# Altium schematic sheet TSI_SAMP_SAMI_V3.4.SchDoc (part 2 of 2)
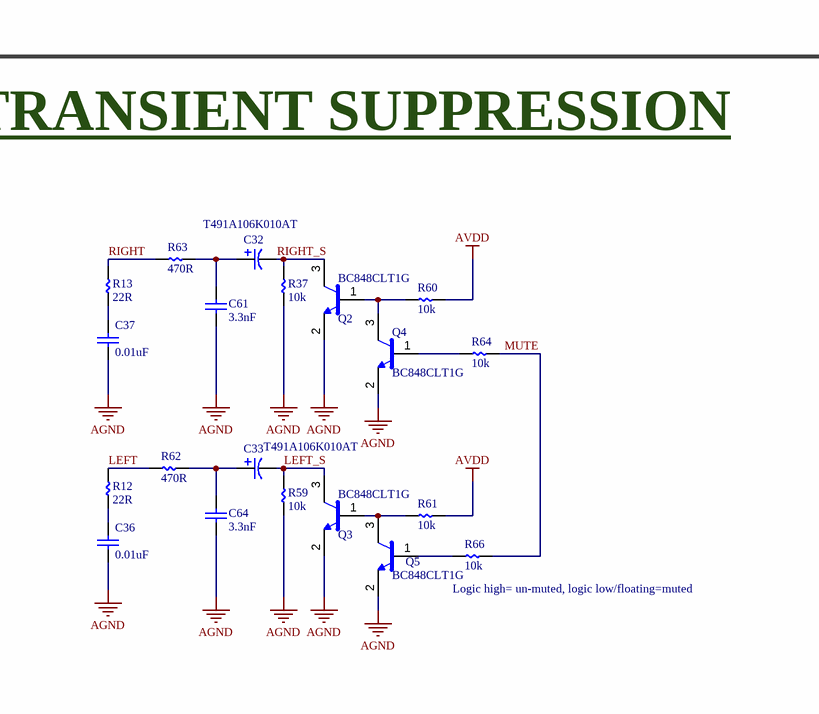
[diagram p6: TSI_SAMP_SAMI_V3.4.SchDoc, bottom right]

## Library data of the parts
C1-C4 = CAP_470pF_0603: 470 pF ±10% 50V Ceramic Capacitor X7R 0603 (1608 Metric); Supplier 1: Digi-Key; Supplier Part Number 1: 311-1078-1-ND
C5-C8 C10 C18 C23 C26 C34 C40 C43-C47 C50 C55 C56 = CAP_0.1uF_0603: 0603 100 nF 25 V -20 / +80 % Tolerance Y5V SMT Multilayer Ceramic Capacitor; Manufacturer: Kyocera AVX; Manufacturer Part Number: KGM15AV51E104ZT; Capacitance: 100nF; Voltage Rating (DC): 25V; Tolerance: 80%; Dissipation Factor: 7%; Insulation Resistance: 100GR; RoHS: Yes; Category: Ceramic Capacitors; Mount: Surface Mount,PCB; Case/Package: 0603; Number of Pins: 2; Case Code (Imperial): 0603; Case Code (Metric): 1608; Contact Plating: Tin,Matte; Case Code: 0603; Min Operating Temperature: -30°C; Max Operating Temperature: 85°C; Packaging: Tape and Reel; Voltage Rating: 25V; Package Quantity: 1; Dielectric: Y5V; Termination: SMD/SMT; Voltage: 25V; Series: -; Construction: Flat; Length: 1.6mm; Width: 0.032inch; Height: 0.9mm; Thickness: 0.035inch; Depth: 0.81mm; Radiation Hardening: No; REACH SVHC: No SVHC; Lead Free: Lead Free; RoHS Compliant: Yes; ComponentLink1URL: https://datasheet.ciiva.com/11786/0900766b802d4699-11786267.pdf?src-supplier=RSComponents; ComponentLink1Description: https://datasheet.ciiva.com/11786/0900766b802d4699-11786267.pdf?src-supplier=RSComponents; ComponentLink2URL: https://datasheet.ciiva.com/1124/318409-1124608.pdf?src-supplier=Element14; ComponentLink2Description: https://datasheet.ciiva.com/1124/318409-1124608.pdf?src-supplier=Element14; ComponentLink3URL: https://datasheet.ciiva.com/203/cy5v-203689.pdf?src-supplier=Digi-Key; ComponentLink3Description: https://datasheet.ciiva.com/203/cy5v-203689.pdf?src-supplier=Digi-Key; ComponentLink4URL: https://datasheet.ciiva.com/203/cy5v-203690.pdf?src-supplier=Digi-Key; ComponentLink4Description: https://datasheet.ciiva.com/203/cy5v-203690.pdf?src-supplier=Digi-Key; ComponentLink5URL: https://datasheet.ciiva.com/203/cy5v-203691.pdf?src-supplier=Digi-Key; ComponentLink5Description: https://datasheet.ciiva.com/203/cy5v-203691.pdf?src-supplier=Digi-Key; ComponentLink6URL: https://datasheet.ciiva.com/11464/cy5v-11464567.pdf?src-supplier=Avnet; ComponentLink6Description: https://datasheet.ciiva.com/11464/cy5v-11464567.pdf?src-supplier=Avnet; ComponentLink7URL: https://datasheet.ciiva.com/2987/cy5v-2987766.pdf?src-supplier=Avnet; ComponentLink7Description: https://datasheet.ciiva.com/2987/cy5v-2987766.pdf?src-supplier=Avnet; ComponentLink8URL: https://datasheet.ciiva.com/1124/578190-1124654.pdf?src-supplier=Element14; ComponentLink8Description: https://datasheet.ciiva.com/1124/578190-1124654.pdf?src-supplier=Element14; ComponentLink9URL: https://datasheet.ciiva.com/1124/578190-1124655.pdf?src-supplier=Element14; ComponentLink9Description: https://datasheet.ciiva.com/1124/578190-1124655.pdf?src-supplier=Element14; ComponentLink10URL: https://datasheet.ciiva.com/14590/70001073-14590664.pdf?src-supplier=Allied+Electronics; ComponentLink10Description: https://datasheet.ciiva.com/14590/70001073-14590664.pdf?src-supplier=Allied+Electronics; ComponentLink11URL: https://datasheet.ciiva.com/28613/578190-28613276.pdf?src-supplier=Element14; ComponentLink11Description: https://datasheet.ciiva.com/28613/578190-28613276.pdf?src-supplier=Element14; ComponentLink12URL: https://datasheet.ciiva.com/16484/cy5v-16484423.pdf?src-supplier=Avnet+Asia; ComponentLink12Description: https://datasheet.ciiva.com/16484/cy5v-16484423.pdf?src-supplier=Avnet+Asia; Supplier 1: DigiKey; Supplier Part Number 1: 478-KGM15AV51E104ZTCT-ND
C9 C12 C15 C21 C25 C35 C38 C39 C53 C54 C63 C67-C69 = CAP_10uF_0603: Yageo - CC0603MRX5R7BB106 - CAP, MLCC, X5R, 10uF, 16V, 0603; Dielectric Material: Ceramic; Tolerance: 20%; Supplier 1: DigiKey; Supplier Part Number 1: 311-1822-1-ND; Manufacturer: Yageo; Manufacturer Part Number: CC0603MRX5R7BB106; RoHS: Yes; Category: Ceramic Capacitors; Stock 1: 109429; Pricing 1: 1=0.32000, 10=0.22000, 50=0.14680, 100=0.12470, 500=0.08804, 1000=0.07704 (USD); Mount: PCB,Surface Mount; Case/Package: 0603; Number of Pins: 2; Case Code (Imperial): 0603; Case Code (Metric): 1608; Min Operating Temperature: -55°C; Max Operating Temperature: 85°C; Capacitance: 10uF; Packaging: Tape and Reel; Dielectric: X5R; Voltage Rating: 16V; Voltage Rating (DC): 16V; Construction: Flat; Termination: SMD/SMT; Length: 1.6mm; Height: 0.8mm; Depth: 0.8mm; Radiation Hardening: No; RoHS Compliant: Yes; REACH SVHC: No SVHC; Supplier 2: Mouser; Supplier Part Number 2: 603-CC603MRX5R7BB106
C11 = CAP_1nF_0603: CAP CER 0603 1NF 16V X7R 10%; Supplier 1: Digi-Key; Supplier Part Number 1: 399-17878-1-ND
C13 C14 C20 C24 C27 C29-C31 C57 = CAP_1uF_0603: 0603 1 uF 50 V ±10% Tolerance X5R Surface Mount Multilayer Ceramic Capacitor; Manufacturer: Taiyo Yuden; Manufacturer Part Number: UMK107BJ105KA-T; Voltage Rating: 50V; Supplier 1: Digi-Key; RoHS: Yes; Category: Ceramic Capacitors; Stock 1: 555277; Pricing 1: 1=0.19000, 10=0.12900, 50=0.07760, 100=0.06560, 500=0.04484, 1000=0.03968 (USD); Mount: Surface Mount; Case/Package: 0603; Number of Pins: 2; Case Code (Metric): 1608; Case Code (Imperial): 0603; Contact Plating: Nickel; Min Operating Temperature: -55°C; Max Operating Temperature: 85°C; Capacitance: 1uF; Tolerance: 10%; Packaging: Tape and Reel; Package Quantity: 1; Voltage Rating (DC): 50V; Dielectric: X5R; Termination: SMD/SMT; Series: M; Construction: Flat; Length: 1.6mm; Width: 0.031inch; Height: 0.8mm; Thickness: 0.035inch; Depth: 0.8mm; Radiation Hardening: No; RoHS Compliant: Yes; REACH SVHC: Unknown; Halogen Free: Halogen Free; ComponentLink1URL: https://datasheet.ciiva.com/134/umk107bj105ka-t-ss-134740.pdf?src-supplier=Digi-Key; ComponentLink1Description: https://datasheet.ciiva.com/134/umk107bj105ka-t-ss-134740.pdf?src-supplier=Digi-Key; ComponentLink2URL: https://datasheet.ciiva.com/11601/umk107bj105ka-t-ss-11601811.pdf?src-supplier=Avnet; ComponentLink2Description: https://datasheet.ciiva.com/11601/umk107bj105ka-t-ss-11601811.pdf?src-supplier=Avnet; ComponentLink3URL: https://datasheet.ciiva.com/5744/1697715-5744913.pdf?src-supplier=Farnell; ComponentLink3Description: https://datasheet.ciiva.com/5744/1697715-5744913.pdf?src-supplier=Farnell; ComponentLink4URL: https://datasheet.ciiva.com/30199/43umk107bj105ka-t-30199791.pdf?src-supplier=Onlinecomponents.com; ComponentLink4Description: https://datasheet.ciiva.com/30199/43umk107bj105ka-t-30199791.pdf?src-supplier=Onlinecomponents.com; ComponentLink5URL: https://datasheet.ciiva.com/15922/336umk107bj105ka-t-15922611.pdf?src-supplier=Onlinecomponents.com; ComponentLink5Description: https://datasheet.ciiva.com/15922/336umk107bj105ka-t-15922611.pdf?src-supplier=Onlinecomponents.com; ComponentLink6URL: https://datasheet.ciiva.com/5427/mlcc-all-e-541559-5427036.pdf?src-supplier=Mouser; ComponentLink6Description: https://datasheet.ciiva.com/5427/mlcc-all-e-541559-5427036.pdf?src-supplier=Mouser; ComponentLink7URL: https://datasheet.ciiva.com/7975/mlcc-all-e-7975898.pdf?src-supplier=Element14; ComponentLink7Description: https://datasheet.ciiva.com/7975/mlcc-all-e-7975898.pdf?src-supplier=Element14; ComponentLink8URL: https://datasheet.ciiva.com/7975/1697715-7975608.pdf?src-supplier=Element14; ComponentLink8Description: https://datasheet.ciiva.com/7975/1697715-7975608.pdf?src-supplier=Element14; ComponentLink9URL: https://datasheet.ciiva.com/22694/1697715-22694278.pdf?src-supplier=Element14; ComponentLink9Description: https://datasheet.ciiva.com/22694/1697715-22694278.pdf?src-supplier=Element14; Supplier Part Number 1: 587-2400-1-ND
C16 C17 = CAP CER 10UF 16V X7R 1206: 10µF ±20% 16V Ceramic Capacitor X7R 1206 (3216 Metric); Manufacturer: Samsung Electro-Mechanics; Manufacturer Part Number: CL31B106MOHNNNE; Value: 10uF; Manufacturer Link: https://media.digikey.com/pdf/Data%20Sheets/Samsung%20PDFs/CL_Series_MLCC_ds.pdf; RoHS: 3; Temperature Range: -55°C ~ 125°C; Supplier 1: Digi-Key; Supplier 2: Future Electronics; Supplier Part Number 1: 1276-6641-1-ND; Supplier Part Number 2: 2114712
C19 C22 = CAP ALUM 330UF 20% 50V SMD: 330µF 50V Aluminum Electrolytic Capacitors Radial, Can - SMD 120mOhm @ 100kHz 5000 Hrs @ 105°C; Manufacturer: Panasonic Electronic Components; Manufacturer Part Number: EEE-FT1H331GP; Value: 330uF; Manufacturer Link: https://b2b-api.panasonic.eu/file_stream/pids/fileversion/3127; RoHS: 3; Temperature Range: -55°C ~ 105°C; Supplier 1: Digi-Key; Supplier Part Number 1: 732-8514-1-ND
C28 = CAP 2.2uF 0603 16V X7R 10%: 2.2µF ±10% 16V Ceramic Capacitor X7R 0603 (1608 Metric); Manufacturer: Taiyo Yuden; Manufacturer Part Number: EMK107BB7225KA-T; Value: 2.2uF; Manufacturer Link: https://www.yuden.co.jp/productdata/catalog/mlcc06_e.pdf; RoHS: ROHS3 Compliant; Temperature Range: -55°C ~ 125°C; Supplier 1: Digi-Key; Supplier Part Number 1: 587-5835-1-ND; Supplier 2: Mouser; Supplier Part Number 2: 81-GRM188R71A225KE15
C32 C33 = T491A106K010AT: T491, Tantalum, MnO2 Tantalum, Commercial Grade, 10 uF, 10%, 10 VDC, SMD, MnO2, Molded, 3.8 Ohms, 3216, Height Max = 1.8mm; Manufacturer Name: Kemet; Copyright: Copyright (C) 2025 Ultra Librarian. All rights reserved.; Supplier 1: DigiKey; Supplier Part Number 1: 399-3684-1-ND; Supplier 2: Mouser; Supplier Part Number 2: 80-T491A106K010; Manufacturer Part Number: T491A106K010AT
C36 C37 = CAP_0.01uF_0603: CAP CER SMD 0603 .01UF 5% X7R 50; Supplier 1: Digi-Key; Supplier Part Number 1: 399-17568-1-ND
C41 C42 = CAP_22pF_0603: 22 pF ±5% 250V Ceramic Capacitor C0G, NP0 0603 (1608 Metric); Supplier 1: Digi-Key; Supplier Part Number 1: 311-3095-1-ND
C48 C49 = CAP_15pF_0603: Manufacturer: KYOCERA AVX; Manufacturer Product Number: KGM15ACG1H150JT; Supplier 1: DigiKey; Supplier Part Number 1: 478-KGM15ACG1H150JTCT-ND
C51 C52 = CAP_10nF_0603: 10000 pF ±5% 16V Ceramic Capacitor X8R 0603 (1608 Metric); Supplier 1: Digi-Key; Supplier Part Number 1: 399-C0603X103J4HAC7867CT-ND
C58 C59 = CAP_1uF_1210: CAP CER 1UF 50V X7R 1210; Manufacturer 1: KEMET; Manufacturer Product Number 1: C1210C105J5RACTU; Supplier 1: Digi-Key; Supplier Part Number 1: 399-C1210C105J5RAC7800CT-ND
C60 = CAP_100pF_0603: CAP CER 100PF 50V X8R 0603; Supplier 1: Digi-Key; Supplier Part Number 1: 399-C0603C101F5HAC7867CT-ND
C61 C64 = CAP_3.3nF_0603: 0603 3.3nF SMT Multilayer Ceramic Capacitor; Manufacturer: KEMET; Manufacturer Part Number: C0603C332J5RACTU; Voltage Rating (DC): 50V; Tolerance: 5%; Dielectric: X7R; Dissipation Factor: 7%; Insulation Resistance: 100GR; RoHS: Yes; Category: Ceramic Capacitors; Mount: Surface Mount,PCB; Case/Package: 0603; Number of Pins: 2; Case Code (Imperial): 0603; Case Code (Metric): 1608; Contact Plating: Tin,Matte; Case Code: 0603; Min Operating Temperature: -55°C; Max Operating Temperature: 125°C; Capacitance: 3.3nF; Packaging: Tape and Reel; Voltage Rating: 50V; Package Quantity: 1; Termination: SMD/SMT; Voltage: 50V; Series: -; Construction: Flat; Length: 1.6mm; Width: 0.032inch; Height: 0.9mm; Thickness: 0.035inch; Depth: 0.81mm; Radiation Hardening: No; REACH SVHC: No SVHC; Lead Free: Lead Free; RoHS Compliant: Yes; Supplier 1: DigiKey; Supplier Part Number 1: 399-C0603C332J5RACTUCT-ND
C62 = CAP_0.047uF_0603: CAP CER 0.047UF 50V X7R 0603; Manufacturer: KEMET; Manufacturer Product Number: C0603C473K5RACTU; Supplier 1: DigiKey; Supplier Part Number 1: 399-C0603C473K5RACTUCT-ND
C65 C66 = CAP_0.47uF_0603: 0.47 µF ±20% 25V Ceramic Capacitor X5R 0603 (1608 Metric); Supplier 1: Digi-Key; Supplier Part Number 1: 732-7917-1-ND
D1 D2 = TPD2E007DCKR: TVS DIODE 13V SC70-3; Manufacturer: Texas Instruments; Manufacturer Part Number: TPD2E007DCKR; Manufacturer Link: https://www.ti.com/lit/ds/symlink/tpd2e007.pdf?HQS=TI-null-null-digikeymode-df-pf-null-wwe&ts=1600795141321; Value: TPD2E007DCKR; RoHS: ROHS3 Compliant; Temperature Range: -40°C~85°C (TA); Supplier 1: DigiKey; Supplier Part Number 1: 296-25281-1-ND
D3 = SCHOTTKY_20V_3A_SMB: Diode Schottky 20V 3A 2-Pin SMB T/R; Manufacturer: Diodes; Manufacturer Part Number: B320B-13-F; Number of Terminals/Pins: 2; Package Body Material: Plastic; Diode Element Material: SILICON; Max Reverse Current: 500uA; Peak Non-Repetitive Surge Current: 100A; Element Configuration: Single; Forward Voltage: 500mV; Number of Elements: 1; Polarity: Standard; Capacitance: 250pF; Application(s): EFFICIENCY; Diode Type: RECTIFIER; Time @ Peak Reflow Temperature-Max (s): 5s; Supplier 1: Digi-Key; RoHS: Yes; Category: Schottky Diodes; Stock 1: 1260; Pricing 1: 1=0.43000, 10=0.37100, 100=0.27720, 500=0.21780, 1000=0.16830 (USD); Mount: Surface Mount; Case/Package: SMB; Number of Pins: 2; Weight: 0.00328oz; Contact Plating: Tin,Matte; Package Shape: Rectangular; Terminal Finish: Tin; Min Operating Temperature: -55°C; Max Operating Temperature: 150°C; Forward Current: 3A; Max Repetitive Reverse Voltage (Vrrm): 20V; Packaging: Tape and Reel; Package Quantity: 3000; Average Rectified Current: 3A; Max Forward Surge Current (Ifsm): 100A; Termination: SMD/SMT; Voltage Rating (DC): 20V; Current Rating: 3A; Output Current: 3A; Max Reverse Voltage (DC): 20V; Series: -; JESD-30 Code: R-PDSO-C2; Terminal Form: C BEND; Terminal Position: DUAL; Number of Phases: 1; Surface Mount: Yes; Moisture Sensitivity Level: 1; Technology: SCHOTTKY; Peak Reflow Temperature (Cel): 245°C; Length: 4.57mm; Width: 3.94mm; Height: 2.5mm; Radiation Hardening: No; Lead Free: Lead Free; ComponentLink1URL: https://datasheet.ciiva.com/26949/getdatasheetpartid-143396-26949350.pdf?src-supplier=Verical; ComponentLink1Description: https://datasheet.ciiva.com/26949/getdatasheetpartid-143396-26949350.pdf?src-supplier=Verical; ComponentLink2URL: https://datasheet.ciiva.com/19477/1589540-19477593.pdf?src-supplier=Jameco; ComponentLink2Description: https://datasheet.ciiva.com/19477/1589540-19477593.pdf?src-supplier=Jameco; ComponentLink3URL: https://datasheet.ciiva.com/26788/b320b-13-f-26788850.pdf?src-supplier=IIIC; ComponentLink3Description: https://datasheet.ciiva.com/26788/b320b-13-f-26788850.pdf?src-supplier=IIIC; ComponentLink4URL: https://datasheet.ciiva.com/914/ds30924-914408.pdf?src-supplier=Digi-Key; ComponentLink4Description: https://datasheet.ciiva.com/914/ds30924-914408.pdf?src-supplier=Digi-Key; ComponentLink5URL: https://datasheet.ciiva.com/914/ds30924-914409.pdf?src-supplier=Digi-Key; ComponentLink5Description: https://datasheet.ciiva.com/914/ds30924-914409.pdf?src-supplier=Digi-Key; ComponentLink6URL: https://datasheet.ciiva.com/914/ds30924-914410.pdf?src-supplier=Digi-Key; ComponentLink6Description: https://datasheet.ciiva.com/914/ds30924-914410.pdf?src-supplier=Digi-Key; ComponentLink7URL: https://datasheet.ciiva.com/25946/ds30924-25946725.pdf?src-supplier=Avnet+Europe; ComponentLink7Description: https://datasheet.ciiva.com/25946/ds30924-25946725.pdf?src-supplier=Avnet+Europe; Supplier Part Number 1: B320B-FDICT-ND
D4 = LED_GREEN_0603: LED GREEN CLEAR SMD; Supplier 1: Digi-Key; Supplier Part Number 1: 160-1446-1-ND
D5 D6 = LED_RED_0603: LED RED CLEAR SMD; Supplier 1: Digi-Key; Supplier Part Number 1: 160-1447-1-ND
DS1 = LCD_Screen_16x2: SPARKFUN 16X2 SERLCD - RGB TEXT; Manufacturer: SparkFun Electronics; Manufacturer Product Number: 16397; Supplier 1: Digi-Key
F1-F3 = FER_8A_4mOHM_0603: 8.5 Ohms @ 100 MHz 1 Power Line Ferrite Bead 0603 (1608 Metric) 8A 4mOhm; Supplier 1: Digi-Key; Supplier Part Number 1: 490-BLE18PS080SN1DCT-ND
FB1-FB4 = FERRITE BEAD 220 OHM 0805 1LN: 220 Ohms @ 100MHz 1 Power Line Ferrite Bead 0805 (2012 Metric) 3A 40mOhm; Manufacturer: TDK Corporation; Manufacturer Part Number: MPZ2012S221AT000; Value: 220R 3A; Manufacturer Link: https://product.tdk.com/info/en/catalog/datasheets/beads_commercial_power_mpz2012_en.pdf?ref_disty=digikey; RoHS: 3; Temperature Range: -55°C ~ 125°C; Supplier 1: Digi-Key; Supplier Part Number 1: 240-2392-1-ND
H1 = TAG_CONNECT_TC2030: TC2030-IDC; Supplier 1: Digi-Key; Supplier Part Number 1: TC2030-IDC-ND
H2 = 16-Pin_B2B: Mechanical Part DW-16-07-T-S-200 for use as board to board connector for DS1; Manufacturer 1: Samtec Inc.; Supplier 1: Mouser; Supplier Part Number 1: 200-DW1607TS200; Supplier 2: DigiKey; Supplier Part Number 2: DW-16-07-T-S-200-ND; Manufacturer Product Number 1: DW-16-07-T-S-200
J1 = CONN_DC_JACK_2.1mmID_5.5mmOD_RA_TH: Power Barrel Connector Jack 2.10mm ID (0.083"), 5.50mm OD (0.217") Through Hole, Right Angle; Supplier 1: Digi-Key; Supplier 2: Mouser; Supplier Part Number 1: CP-051AH-ND; Supplier Part Number 2: 490-PJ-051AH
J2 J5 J12 = CONN_JACK_STEREO_3.5MM_SPDT_RA: 3.50mm (0.141", 1/8", Mini Plug) - Headphone Phone Jack Stereo (3 Conductor, TRS) Connector Solder; Supplier 1: DigiKey; Supplier Part Number 1: CP-SJ-3566AN-ND; Supplier 2: DigiKey; Supplier Part Number 2: CP-SJ-3566AN-ND; Supplier 3: Mouser; Supplier Part Number 3: 490-SJ-3566AN
J3 J4 = CONN_3.5MM_COMBO: 3.50mm (0.141", 1/8", Mini Plug) - Headphone Phone Jack Stereo (3 Conductor, TRS) Connector Solder; Supplier 1: Digi-Key; Supplier Part Number 1: 2092-STX-4235-3/3-N-ND
J6 J7 = CONN_3.5MM_STEREO_DBL_VERT_TH: 3.50mm (0.141", 1/8", Mini Plug) - Headphone Phone Jack Stereo (3 Conductor, TRS) Connector Solder; Supplier 1: Digi-Key; Supplier Part Number 1: 2092-STX-4235-3/3-N-ND
J8 = CONN_SD_CARD_SMD: 8 Position Card Connector Secure Digital - microSDâ„¢ Surface Mount, Right Angle Gold; MP: 2908-05WB-MG; MF: 3M; SnapEDA_Link: https://www.snapeda.com/parts/2908-05WB-MG/3M%20%28TC%29/view-part/292159/?ref=snap; Value: *; Package: None; Digi-Key_Part_Number: 3M5607CT-ND; Digi-Key_Purchase_URL: https://www.digikey.in/product-detail/en/3m/2908-05WB-MG/3M5607CT-ND/1242498?utm_source=snapeda&utm_medium=aggregator&utm_campaign=symbol; Supplier 1: Digi-Key; Supplier Part Number 1: 3M5607CT-ND
J9 = 687310124422: Wurth Elektronik 687 0.5mm Pitch 10 Way Straight SMT FPC Connector; Geometry.Height: 4.45mm; Mouser Part Number: 710-687310124422; Mouser Price/Stock: https://www.mouser.co.uk/ProductDetail/Wurth-Elektronik/687310124422?qs=qR1qlUC5%2FYSwH5sZ3IPHvQ%3D%3D; Manufacturer_Name: Wurth Elektronik; Manufacturer_Part_Number: 687310124422; Datasheet Link: https://www.we-online.com/catalog/datasheet/687310124422.pdf
J10 = 68000-105HTLF: 68000-105HTLF-B/S SR HDR 1*5; Manufacturer 1: Amphenol Communication Solutions; Geometry.Height: 8.58mm; Datasheet Link: https://cdn.amphenol-cs.com/media/wysiwyg/files/drawing/68000.pdf; Manufacturer Part Number 1: 68000-105HTLF; Supplier 1: DigiKey; Supplier Part Number 1: 609-68000-105HTLF-ND; Supplier 2: Mouser; Supplier Part Number 2: 649-68000-105HTLF
J11 = 3220-10-0300-00: Connector Header Surface Mount 10 position 0.050" (1.27mm); Manufacturer 1: CNC Tech; Datasheet Link: https://www.cnctech.us/pdfs/3220-XX-0300-00_.pdf; Supplier 1: DigiKey; Supplier Part Number 1: 1175-1629-ND; Manufacturer Part Number 1: 3220-10-0300-00
M1 = LED Dome_4LED: LENS WHITE 170DEG DIFFUSER SNAP; Manufacturer: Khatod North America LLC; Manufacturer Part Number: PLJT20; Lens Style: Round with Domed Top; Lens Size: 23mm Dia; Lens Transparency: Diffused; Viewing Angle: 170°; RoHS: RoHS Compliant; Category: Optoelectronics; Stock 1: 241; Pricing 1: 1=3.32, 10=2.941, 50=2.1818, 100=1.8972, 250=1.70748 (USD); Part Status: Active; Type: Lens; Color: White; Optical Pattern: Diffuser; For Use With/Related Manufacturer: -; Material: Polycarbonate; Mounting Type: Snap In; ComponentLink1URL: http://download.khatod.com/documents/pljt20_test_report.pdf; ComponentLink1Description: http://download.khatod.com/documents/pljt20_test_report.pdf; Supplier 1: Digi-Key
MK1 = MIC_ELECTRET_CASTLE_PAD: 20 Hz ~ 20 kHz Analog Microphone Electret Condenser Omnidirectional (-24dB ±3dB) Solder Pads; Manufacturer Product Number: AOM-5024L-HD-R; Manufacturer: PUI Audio, Inc.; Supplier 1: Digi-Key; Supplier Part Number 1: 668-1596-ND
P1 = TERM BLK 4P SIDE ENT 2.54MM PCB: 4 Position Wire to Board Terminal Block Horizontal with Board 0.100" (2.54mm) Through Hole; Manufacturer: Phoenix Contact; Value: 1725672; Manufacturer Link: https://media.digikey.com/pdf/Data%20Sheets/Phoenix%20Contact%20PDFs/1725672.pdf; Manufacturer Part Number: 1725672; RoHS: Y; Temperature Range: *; Supplier 1: Digi-Key; Supplier 2: Mouser; Supplier Part Number 1: 277-1275-ND; Supplier Part Number 2: 651-1725672
P2 = TERM BLK 2P SIDE ENT 2.54MM PCB: 2 Position Wire to Board Terminal Block Horizontal with Board 0.100" (2.54mm) Through Hole; Manufacturer: Phoenix Contact; Value: 1725656; Manufacturer Link: https://media.digikey.com/pdf/Data%20Sheets/Phoenix%20Contact%20PDFs/1725656_Ds.pdf; Manufacturer Part Number: 1725656; RoHS: Y; Temperature Range: *; Supplier 1: Digi-Key; Supplier 2: Mouser; Supplier Part Number 1: 277-1273-ND; Supplier Part Number 2: 651-1725656
Q1 = MOSFET_P-CH_20V_3.6A_SOT23: Trans MOSFET P-CH 20V 3.6A 3-Pin SOT-23 T/R; Manufacturer: ON Semiconductor; Manufacturer Part Number: NTR3A052PZT1G; Rds On Max: 47mR; Input Capacitance: 1.243nF; Max Power Dissipation: 860mW; RoHS: Yes; Category: MOSFETs; Stock 1: 9236; Pricing 1: 1=0.44000, 10=0.37500, 25=0.35040, 100=0.28030, 500=0.22022, 1000=0.17017 (USD); Mount: Surface Mount; Case/Package: TO-236-3; Min Operating Temperature: -55°C; Max Operating Temperature: 150°C; Packaging: Cut Tape; Drain to Source Voltage (Vdss): 20V; Continuous Drain Current (ID): 3.6A; RoHS Compliant: Yes; ComponentLink1URL: http://www.onsemi.com/pub/Collateral/NTR3A052PZ-D.PDF?src-supplier=Digi-Key; ComponentLink1Description: http://www.onsemi.com/pub/Collateral/NTR3A052PZ-D.PDF?src-supplier=Digi-Key; Supplier 1: Digi-Key; Supplier Part Number 1: 31-DMP2045UQ-7CT-ND
R1 R4 R39-R42 R52-R55 = RES_100K_0603: Res Thick Film 0603 100K Ohm 5% 0.33W(1/3W) ±200ppm/°C Pad SMD Automotive T/R; Manufacturer: Vishay Dale; Manufacturer Part Number: CRCW0603100KJNEAHP; Resistance: 100kR; Power Rating: 250mW; Voltage Rating: 75V; Supplier 1: Digi-Key; RoHS: Yes; Category: Chip SMD Resistors; Stock 1: 27580; Pricing 1: 1=0.16000, 10=0.13500, 100=0.05290, 1000=0.02215, 2500=0.02030 (USD); Case/Package: 0603; Case Code (Imperial): 0603; Case Code (Metric): 1608; Contact Plating: Tin; Weight: 7.1E-05oz; Min Operating Temperature: -55°C; Max Operating Temperature: 155°C; Packaging: Tape and Reel; Tolerance: 5%; Resistor Type: Thick Film; Temperature Coefficient: 200ppm/°C; Max Power Dissipation: 250mW; Series: CRCW-HP; Number of Terminations: 2; Features: Automotive AEC-Q200; Package Quantity: 5000; Length: 1.6mm; Width: 0.8mm; Height: 0.45mm; Radiation Hardening: No; RoHS Compliant: Yes; Lead Free: Lead Free; ComponentLink1URL: https://datasheet.ciiva.com/5548/crcwhpe3-46056-5548151.pdf?src-supplier=Mouser; ComponentLink1Description: https://datasheet.ciiva.com/5548/crcwhpe3-46056-5548151.pdf?src-supplier=Mouser; Supplier Part Number 1: 541-100KSACT-ND
R2 = RES_3.6M_0603: RES 3.6M OHM 1% 1/10W 0603; Supplier 1: Digi-Key; Supplier Part Number 1: RMCF0603FT3M60CT-ND
R3 = 2M Resistor: RES 2M OHM 5% 1/10W 0603; Manufacturer Part Number 1: RC0603JR-072ML; Manufacturer 1: YAGEO; Supplier 1: DigiKey; Supplier Part Number 1: 311-2.0MGRCT-ND; Supplier 2: Mouser; Supplier Part Number 2: 603-RC0603JR-072ML; Supplier 3: Avnet; Supplier Part Number 3: 49AK2948
R5 R6 R9 R10 = RES_20K_0603: 20 kOhms ±1% 0.1W, 1/10W Chip Resistor 0603 (1608 Metric) Automotive AEC-Q200 Thick Film; Supplier 1: Digi-Key; Supplier Part Number 1: RMCF0603FT20K0CT-ND
R7 = RES_2K1_0603: 2.1 kOhms ±1% 0.1W, 1/10W Chip Resistor 0603 (1608 Metric) Moisture Resistant Thick Film; Manufacturer Product Number: RC0603FR-072K1L; Manufacturer: YAGEO; Supplier 1: DigiKey; Supplier Part Number 1: 311-2.10KHRCT-ND; Resistance: 2.1 kOhms; Supplier 2: Mouser; Supplier Part Number 2: 603-RC0603FR-072K1L
R8 R11 R26 R28 R30 R32 R34 R36 R37 R43 R48-R50 R59-R61 R64 R66 = RES_10K_0603: Res Thick Film 0603 10K Ohm 5% 1/10W 200ppm/C Molded SMD SMD Paper T/R; Manufacturer: Vishay Dale; Manufacturer Part Number: CRCW060310K0JNEA; Resistance: 10kR; Power Rating: 100mW; Voltage Rating: 75V; Temperature Coefficient: 200ppm/°C; RoHS: Yes; Category: Chip SMD Resistors; Stock 1: 2; Pricing 1: 1=0.10000, 10=0.03200, 100=0.01310, 1000=0.00588, 2500=0.00510 (USD); Mount: Surface Mount; Case/Package: 0603; Number of Pins: 2; Case Code (Metric): 1608; Case Code (Imperial): 0603; Contact Plating: Tin; Size Code: 0603; Weight: 7.1E-05oz; Min Operating Temperature: -55°C; Max Operating Temperature: 155°C; Package Quantity: 1; Packaging: Tape and Reel; Series: CRCW; Resistance Tolerance: 5%; Tolerance: 5%; Max Power Dissipation: 100mW; Resistor Type: Thick Film; Number of Terminations: 2; Construction: Rectangular; Termination: SMD/SMT; Voltage Rating (DC): 75V; Features: Automotive AEC-Q200; Length: 1.55mm; Width: 0.033inch; Height: 0.02inch; Depth: 0.85mm; Radiation Hardening: No; REACH SVHC: Unknown; Lead Free: Lead Free; RoHS Compliant: Yes; Military Standard: Not; ComponentLink1URL: https://datasheet.ciiva.com/3256/dcrcwe3-3256943.pdf?src-supplier=Avnet; ComponentLink1Description: https://datasheet.ciiva.com/3256/dcrcwe3-3256943.pdf?src-supplier=Avnet; ComponentLink2URL: https://datasheet.ciiva.com/2461/dcrcwe3-2461971.pdf?src-supplier=Digi-Key; ComponentLink2Description: https://datasheet.ciiva.com/2461/dcrcwe3-2461971.pdf?src-supplier=Digi-Key; ComponentLink3URL: https://datasheet.ciiva.com/2461/dcrcwe3-2461972.pdf?src-supplier=Digi-Key; ComponentLink3Description: https://datasheet.ciiva.com/2461/dcrcwe3-2461972.pdf?src-supplier=Digi-Key; ComponentLink4URL: https://datasheet.ciiva.com/2461/dcrcwe3-2461973.pdf?src-supplier=Digi-Key; ComponentLink4Description: https://datasheet.ciiva.com/2461/dcrcwe3-2461973.pdf?src-supplier=Digi-Key; ComponentLink5URL: https://datasheet.ciiva.com/3256/dcrcwe3-3256942.pdf?src-supplier=Avnet; ComponentLink5Description: https://datasheet.ciiva.com/3256/dcrcwe3-3256942.pdf?src-supplier=Avnet; ComponentLink6URL: https://datasheet.ciiva.com/16343/dcrcwe3-16343525.pdf?src-supplier=Future+Electronics; ComponentLink6Description: https://datasheet.ciiva.com/16343/dcrcwe3-16343525.pdf?src-supplier=Future+Electronics; ComponentLink7URL: https://datasheet.ciiva.com/16755/70201119-16755717.pdf?src-supplier=Allied+Electronics; ComponentLink7Description: https://datasheet.ciiva.com/16755/70201119-16755717.pdf?src-supplier=Allied+Electronics; ComponentLink8URL: https://datasheet.ciiva.com/16515/dcrcwe3-16515020.pdf?src-supplier=Avnet+Asia; ComponentLink8Description: https://datasheet.ciiva.com/16515/dcrcwe3-16515020.pdf?src-supplier=Avnet+Asia; ComponentLink9URL: https://datasheet.ciiva.com/16771/70201119-16771051.pdf?src-supplier=Allied+Electronics; ComponentLink9Description: https://datasheet.ciiva.com/16771/70201119-16771051.pdf?src-supplier=Allied+Electronics; Supplier 1: Digi-Key; Supplier Part Number 1: RMCF0603FT10K0CT-ND
R12 R13 = RES_22R_0603: RES 22 OHM 1% 1/10W 0603; Supplier 1: Digi-Key; Supplier Part Number 1: A129668CT-ND
R14 R15 R44-R47 R58 R71 R73 = RES_1K_0603: 1 kOhms ±1% 0.25W, 1/4W Chip Resistor 0603 (1608 Metric) Pulse Withstanding Thick Film; Supplier 1: Digi-Key; Supplier Part Number 1: 541-3949-1-ND
R16-R19 R27 R29 R31 R33 R35 R65 R67-R70 R72 R74-R92 = RES_0R_0603: RES SMD 0 OHM JUMPER 1/10W 0603; Supplier 1: Digi-Key; Supplier Part Number 1: A106051CT-ND
R20 R21 = RES_4K7_0603: RES 4.7K OHM 1% 1/4W 0603; Supplier 1: Digi-Key; Supplier Part Number 1: A130424CT-ND
R22-R25 = RES_190R_0603: RES 191 OHM 1% 1/10W 0603; Supplier 1: Digi-Key; Supplier Part Number 1: 311-191HRCT-ND
R38 = RES_1M_0603: RES 1M OHM 1% 1/4W 0603; Supplier 1: Digi-Key; Supplier Part Number 1: A130452CT-ND
R51 R56 = RES_100R_0603: 100 Ohms ±1% 0.25W, 1/4W Chip Resistor 0603 (1608 Metric) Pulse Withstanding Thick Film; Supplier 1: Digi-Key; Supplier Part Number 1: 541-3244-1-ND
R57 = RES_10R_0603: 10 Ohms ±1% 0.1W, 1/10W Chip Resistor 0603 (1608 Metric) Automotive AEC-Q200 Thick Film; Supplier 1: Digi-Key; Supplier Part Number 1: RMCF0603FT10R0CT-ND
R62 R63 = 470 Resistor: RES 470 OHM 1% 1/4W 0603; Manufacturer Part Number 1: CRGP0603F470R; Manufacturer 1: TE Connectivity Passive Product; Supplier 1: DigiKey; Supplier Part Number 1: A130412CT-ND
S1 = SW_SLIDE_RA_TH_DPDT: Slide Switch DPDT Through Hole, Right Angle; Supplier 1: Mouser
S2 = SW_SLIDE_SPDT_VERT_TH: SWITCH SLIDE SPDT 300MA 30V; Supplier 1: Digi-Key; Supplier Part Number 1: EG1919-ND
S3 S4 = ENC_ROTARY_20PPR_TH: Rotary Encoder Mechanical 20 Quadrature (Incremental) Vertical; Supplier 1: Digi-Key; Supplier Part Number 1: PEC11L-4115F-S0020-ND
S5 = SW_TACTILE_SPST-NO: Switch, SPNO SMD; Manufacturer: Panasonic; Manufacturer Part Number: EVQ-Q2U03W; Mechanical Life: 200000Cycles; Actuator Color: White; Contact Current Rating: 20mA; Contact Resistance: 100mR; Number of Poles: 1; Operating Force: 2.6N; Throw Configuration: SPST; Voltage Rating (DC): 15V; Illumination Type: Non-Illuminated,Illuminated; Switch Travel: 0.25mm; Max Voltage Rating (AC): 250V; Switch Function: Off-Mom; Actuator Type: Standard; Actuator Length: 1.3mm; Body Depth: 6mm; RoHS: Yes; Category: Tactile Switches; Stock 1: 35170; Pricing 1: 1=0.28000, 10=0.27200, 25=0.25760, 100=0.23310, 250=0.21252, 500=0.19756, 1000=0.16853 (USD); Mount: Surface Mount; Case/Package: SMD/SMT; Contact Plating: Gold,Silver; Color: White; Min Operating Temperature: -40°C; Max Operating Temperature: 85°C; Max Current Rating: 20mA; Packaging: Tape and Reel; Package Quantity: 1; Current Rating: 20mA; Max Voltage Rating (DC): 15V; Termination: SMD/SMT; Electrical Life: 200000Cycles; Orientation: Straight; Series: EVQQ2; Length: 6.5mm; Width: 6mm; Height: 2.5mm; Depth: 6.6mm; Thickness: 1.8mm; Size: 1.8mm; Radiation Hardening: No; REACH SVHC: No SVHC; Lead Free: Lead Free; ComponentLink1URL: https://datasheet.ciiva.com/25603/0900766b810ad3e5-25603904.pdf?src-supplier=RSComponents; ComponentLink1Description: https://datasheet.ciiva.com/25603/0900766b810ad3e5-25603904.pdf?src-supplier=RSComponents; ComponentLink2URL: https://datasheet.ciiva.com/8165/atk0000ce28-8165166.pdf?src-supplier=Avnet; ComponentLink2Description: https://datasheet.ciiva.com/8165/atk0000ce28-8165166.pdf?src-supplier=Avnet; ComponentLink3URL: https://datasheet.ciiva.com/2899/atk0000ce28-2899560.pdf?src-supplier=Digi-Key; ComponentLink3Description: https://datasheet.ciiva.com/2899/atk0000ce28-2899560.pdf?src-supplier=Digi-Key; ComponentLink4URL: https://datasheet.ciiva.com/2899/atk0000ce28-2899561.pdf?src-supplier=Digi-Key; ComponentLink4Description: https://datasheet.ciiva.com/2899/atk0000ce28-2899561.pdf?src-supplier=Digi-Key; ComponentLink5URL: https://datasheet.ciiva.com/2899/atk0000ce28-2899562.pdf?src-supplier=Digi-Key; ComponentLink5Description: https://datasheet.ciiva.com/2899/atk0000ce28-2899562.pdf?src-supplier=Digi-Key; ComponentLink6URL: https://datasheet.ciiva.com/30263/8atk0000ce28-30263950.pdf?src-supplier=Onlinecomponents.com; ComponentLink6Description: https://datasheet.ciiva.com/30263/8atk0000ce28-30263950.pdf?src-supplier=Onlinecomponents.com; ComponentLink7URL: https://datasheet.ciiva.com/17022/70270561-17022925.pdf?src-supplier=Allied+Electronics; ComponentLink7Description: https://datasheet.ciiva.com/17022/70270561-17022925.pdf?src-supplier=Allied+Electronics; ComponentLink8URL: https://datasheet.ciiva.com/16438/atk0000ce28-16438077.pdf?src-supplier=Future+Electronics; ComponentLink8Description: https://datasheet.ciiva.com/16438/atk0000ce28-16438077.pdf?src-supplier=Future+Electronics; ComponentLink9URL: https://datasheet.ciiva.com/46401/28111-46401279.pdf?src-supplier=Element14; ComponentLink9Description: https://datasheet.ciiva.com/46401/28111-46401279.pdf?src-supplier=Element14; Supplier 1: Digi-Key; Supplier Part Number 1: P12955SCT-ND
T4 T7 T8 T10-T13 = CONN_TP_SMD: Test Point
TP1 TP2 = TEST POINT ROUND SMD 0.6mm
U1 = LIPO-CHARGING_8.4V_10DFN: IC BATT CHG LI-ION 2CELL 10DFN; Manufacturer: Microchip; Manufacturer Part Number: MCP73213-A6SI/MF; Number of Cells: 2; Max Supply Voltage: 13V; Fault Protection: Over Voltage; Supplier 1: DigiKey; RoHS: No; Category: Battery Management; Stock 1: 347; Pricing 1: 1=1.88000 (USD); Case/Package: DFN; Min Operating Temperature: -40°C; Max Operating Temperature: 85°C; Packaging: Rail/Tube; Max Charge Current: 1.1A; Battery Pack Voltage: 8.4V; ComponentLink1URL: http://www.microchip.com/mymicrochip/filehandler.aspx?ddocname=en026002&src-supplier=Digi-Key; ComponentLink1Description: http://www.microchip.com/mymicrochip/filehandler.aspx?ddocname=en026002&src-supplier=Digi-Key; Supplier Part Number 1: MCP73213-A6SI/MF-ND
U2 = MAX9744: Amplifier IC 2-Channel (Stereo) Class D 44-TQFN-EP (7x7); Manufacturer: Maxim Integrated; Manufacturer Part Number: MAX9744ETH+T; Value: MAX9744; Manufacturer Link: https://datasheets.maximintegrated.com/en/ds/MAX9744.pdf; RoHS: 3; Temperature Range: -40°C ~ 85°C (TA); Supplier 1: Digi-Key; Supplier 2: Mouser; Supplier Part Number 1: MAX9744ETH+TCT-ND; Supplier Part Number 2: 700-MAX9744ETH+T
U3 U5 = MAX6818EAP+T: Switch Interfacing Interface 20-SSOP; MF: Maxim Integrated; MP: MAX6818EAP+T; Package: SSOP-20 Maxim; Availability: Unavailable; Value: *; Price: None; SnapEDA_Link: https://www.snapeda.com/parts/MAX6818EAP+T/Maxim%20Integrated/view-part/584081/?ref=snap; Supplier 1: Digi-Key
  U3: Supplier Part Number 1: MAX6818EAP+TCT-ND
U4 = IC_REG_LINEAR_3V3_1V8_SMD: Linear Voltage Regulator IC Positive Fixed 2 Output 150mA, 150mA SOT-26; Supplier 1: Digi-Key; Supplier Part Number 1: AP7312-1833W6-7DICT-ND
U6-U9 = IC_SSR_NO_SMD: Solid State SPST-NO (1 Form A) 6-SMD, Gull Wing; Supplier 1: Digi-Key; Supplier Part Number 1: 264-TLP170AM(V4TPLECT-ND
U10 = IC_MDBT50Q-1M_SMD: MDBT50Q-1M NRF52840 BASED BLE MO; Manufacturer: Raytac; Manufacturer Part Number: MDBT50Q-1MV2; Interface: I2C,SPI,USB,ADC,GPIO,UART; Frequency: 2.5GHz; Data Rate: 2Mbps; Sensitivity: -103dBm; Memory Size: 256KB; Current - Receiving: 32.7mA; Current - Transmitting: 11.1mA; Supplier 1: Mouser; RoHS: No; Category: RF Receivers, Transceivers; Pricing 1: 1=10.10000 (USD); Mount: Surface Mount; Case/Package: SMD/SMT; Min Operating Temperature: -40°C; Max Operating Temperature: 85°C; ComponentLink1URL: http://www.raytac.com/download/index.php?index_id=24&src-supplier=Digi-Key; ComponentLink1Description: http://www.raytac.com/download/index.php?index_id=24&src-supplier=Digi-Key; Supplier 2: DigiKey; Supplier Part Number 2: 1597-1678-ND
U11 = IC_VS1053B_LQFP48: VS1053B MP3/WAV/OGG/MIDI Player & Recorder (CODEC) Chip; MP: VS1053B-L; MF: VLSI; Availability: Unavailable; Check_prices: https://www.snapeda.com/parts/VS1053B-L/VLSI/view-part/105440/?ref=eda; SnapEDA_Link: https://www.snapeda.com/parts/VS1053B-L/VLSI/view-part/105440/?ref=snap; Price: None; Package: LQFP-48 VLSI; Value: *; Supplier 1: DigiKey; Supplier Part Number 1: 1528-2645-ND; Supplier 2: Mouser; Supplier Part Number 2: 485-1681
U12 = IC_BUF_ESD_CD74HC4050MT: Buffer, Non-Inverting 6 Element 1 Bit per Element Push-Pull Output 16-SOIC; MF: Texas Instruments; Value: *; Price: None; Availability: In Stock; SnapEDA_Link: https://www.snapeda.com/parts/CD74HC4050MT/Texas+Instruments/view-part/?ref=snap; Check_prices: https://www.snapeda.com/parts/CD74HC4050MT/Texas+Instruments/view-part/?ref=eda; Purchase-URL: https://pricing.snapeda.com/search/part/CD74HC4050MT/?ref=eda; Package: SOIC-16 Texas Instruments; MP: CD74HC4050MT; Supplier 1: Digi-Key; Supplier Part Number 1: 296-14529-1-ND
VR1 = POT_1K_LOG_TH_RA: 1k Ohm 2 Gang Logarithmic Panel Mount Potentiometer None 1.0 Kierros Carbon 0.025W, 1/40W PC Pins, Board Locks; Supplier 1: Digi-Key; Supplier Part Number 1: PTD902-1015K-A102-ND
VR2 = 3.3V_REG_D2PAK: IC REG LINEAR 3.3V 1.5A D2PAK; Manufacturer: ON Semiconductor; Manufacturer Part Number: NCP565D2T33R4G; Number of Outputs: 1; Max Input Voltage: 9V; Min Input Voltage: 2.5V; Reference Voltage: 900mV; Polarity: Positive; Accuracy: 3%; Output Type: Fixed; Min Current Limit: 1.6A; Power Rating: 1.506W; Supplier 1: Mouser; RoHS: Yes; Category: Voltage Regulators - Linear; Stock 1: 45; Pricing 1: 1=2.09000, 10=1.88000, 50=1.78000, 100=1.52000, 1000=1.25000, 10000=1.25000 (USD); Mount: Surface Mount; Case/Package: D2PAK; Number of Pins: 3; Contact Plating: Tin,Matte; Min Operating Temperature: -40°C; Max Operating Temperature: 125°C; Max Output Current: 1.5A; Output Voltage: 3.3V; Packaging: Tape and Reel; Output Current: 1.5A; Package Quantity: 800; Dropout Voltage: 900mV; Number of Regulators: 1; Nominal Output Voltage: 3.3V; Output Voltage Accuracy: 3%; Series: -; Length: 10.24mm; Width: 9.347mm; Height: 4.572mm; Radiation Hardening: No; REACH SVHC: No SVHC; Lead Free: Lead Free; Halogen Free: Halogen Free; RoHS Compliant: Yes; ComponentLink1URL: https://datasheet.ciiva.com/8231/ncp565-d-8231702.pdf?src-supplier=Avnet; ComponentLink1Description: https://datasheet.ciiva.com/8231/ncp565-d-8231702.pdf?src-supplier=Avnet; ComponentLink2URL: https://datasheet.ciiva.com/29569/ncp565-d-29569517.pdf?src-supplier=Digi-Key; ComponentLink2Description: https://datasheet.ciiva.com/29569/ncp565-d-29569517.pdf?src-supplier=Digi-Key; ComponentLink3URL: https://datasheet.ciiva.com/29569/ncp565-d-29569518.pdf?src-supplier=Digi-Key; ComponentLink3Description: https://datasheet.ciiva.com/29569/ncp565-d-29569518.pdf?src-supplier=Digi-Key; ComponentLink4URL: https://datasheet.ciiva.com/29569/ncp565-d-29569519.pdf?src-supplier=Digi-Key; ComponentLink4Description: https://datasheet.ciiva.com/29569/ncp565-d-29569519.pdf?src-supplier=Digi-Key; ComponentLink5URL: https://datasheet.ciiva.com/16209/ncp565-d-16209563.pdf?src-supplier=Future+Electronics; ComponentLink5Description: https://datasheet.ciiva.com/16209/ncp565-d-16209563.pdf?src-supplier=Future+Electronics; ComponentLink6URL: https://datasheet.ciiva.com/26178/ncp565-d-26178262.pdf?src-supplier=Avnet+Europe; ComponentLink6Description: https://datasheet.ciiva.com/26178/ncp565-d-26178262.pdf?src-supplier=Avnet+Europe; Supplier Part Number 1: 863-NCP565D2T33R4G
XTAL1 = XTAL - 32.768kHz ECS-.327-12.5-34B-TR: CRYSTAL 32.7680KHZ 12.5PF SMD; Manufacturer: ECS Inc.; Frequency Tolerance: ±20ppm; Operating Mode: Fundamental; Supplier 1: Digi-Key; Manufacturer Part Number: ECS-.327-12.5-34B-TR; RoHS: RoHS Compliant; Category: Crystals, Oscillators, Resonators; Stock 1: 258451; Pricing 1: 1=0.54, 10=0.448, 50=0.4034, 100=0.3586, 500=0.34068, 1000=0.28688 (USD); Packaging: Cut Tape (CT); Part Status: Active; Type: kHz Crystal (Tuning Fork); Frequency Stability: -; Load Capacitance: 12.5pF; Operating Temperature: -40°C ~ 85°C; Ratings: -; Mounting Type: Surface Mount; Package / Case: 2-SMD, No Lead; Size / Dimension: 0.126" L x 0.059" W (3.20mm x 1.50mm); Height - Seated (Max): 0.035" (0.90mm); ComponentLink1URL: http://www.ecsxtal.com/store/pdf/ecx-31b.pdf; ComponentLink1Description: http://www.ecsxtal.com/store/pdf/ecx-31b.pdf; Supplier Part Number 1: 50-ECS-.327-12.5-34B-TRCT-ND
XTAL2 = XTAL_12.288MHz_SMD: CRYSTAL 12.2880MHZ 10PF SMD; Supplier 1: Digi-Key; Supplier Part Number 1: 535-10902-1-ND
Q2-Q5 = BC848CLT1G: Supplier 1: DigiKey; Supplier 2: Mouser; Supplier Part Number 1: BC848CLT1GOSDKR-ND; Supplier Part Number 2: 863-BC848CLT1G